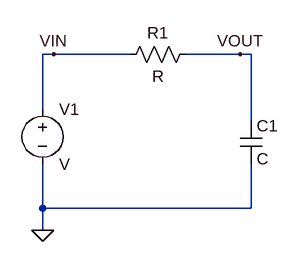
[diagram p0: schematic Test1.asc]
Test1.asc, the LTspice schematic file:
Version 4
SHEET 1 880 1280
WIRE 48 400 32 400
WIRE 160 400 48 400
WIRE 320 400 240 400
WIRE 336 400 320 400
WIRE 32 480 32 400
WIRE 336 496 336 400
WIRE 32 624 32 560
WIRE 336 624 336 560
WIRE 336 624 32 624
WIRE 32 656 32 624
FLAG 32 656 0
FLAG 48 400 VIN
FLAG 320 400 VOUT
SYMBOL voltage 32 464 R0
SYMATTR InstName V1
SYMBOL res 256 384 R90
WINDOW 0 0 56 VBottom 2
WINDOW 3 32 56 VTop 2
SYMATTR InstName R1
SYMBOL cap 320 496 R0
SYMATTR InstName C1

The netlist it stands for:
* Test1.asc
V1 VIN 0 V
R1 VOUT VIN R
C1 VOUT 0 C
.backanno
.end